# EAGLE design uOsc_1_v3 (EAGLE 9.2.1)

## Sheet 1 of 3
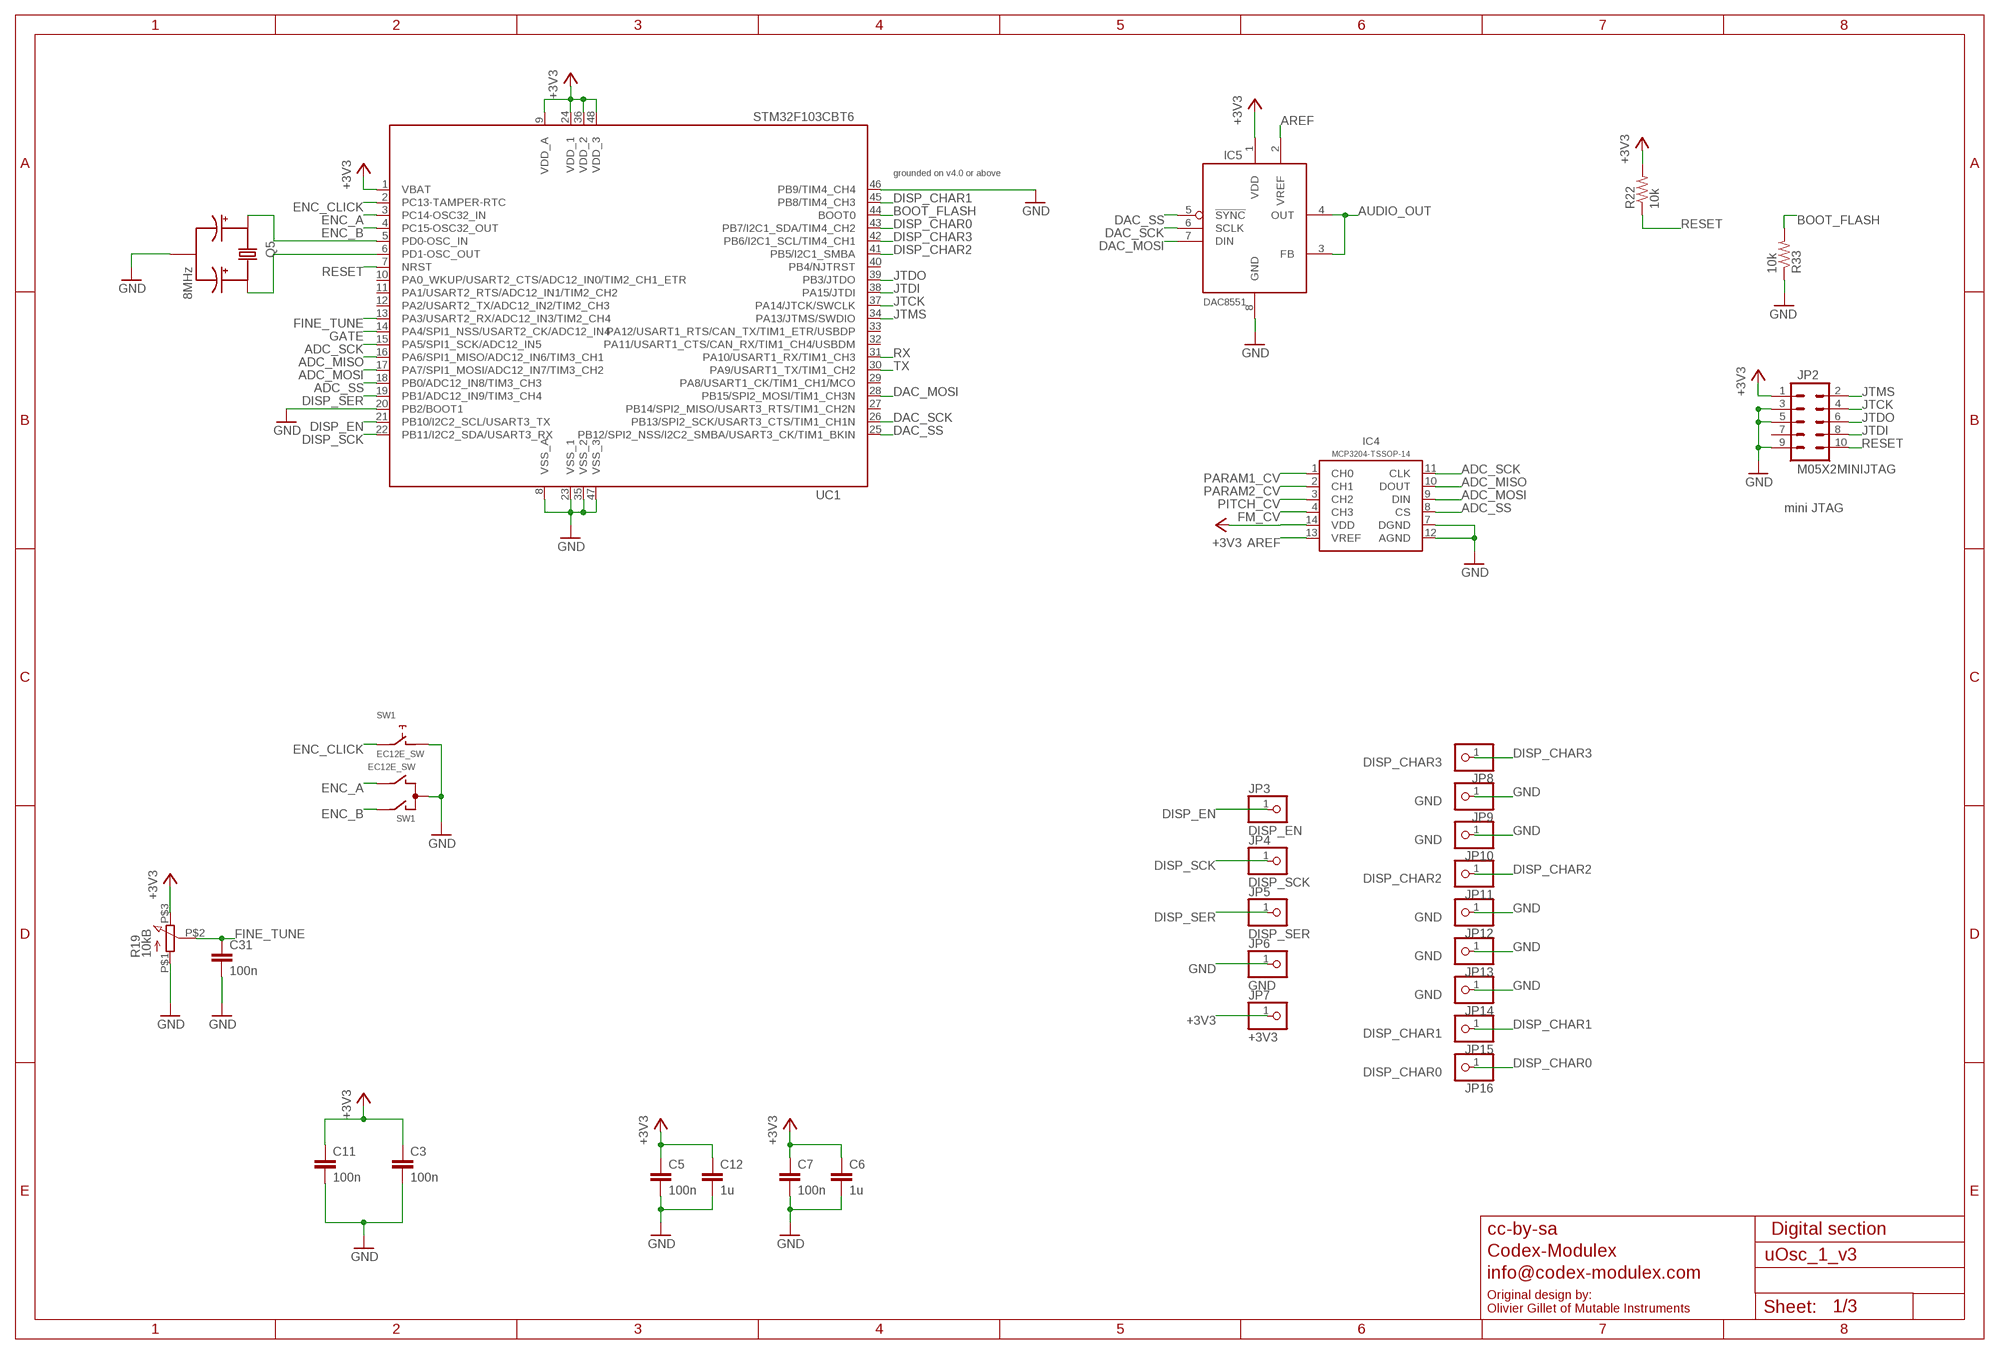
[diagram p0: schematic, sheet 1]

### Parts
C3  100n  PARTS_AMAN_CAPACITOR  [PARTS_AMAN_RESISTOR_0603]
C5  100n  PARTS_AMAN_CAPACITOR  [PARTS_AMAN_RESISTOR_0603]
C6  1u  PARTS_AMAN_CAPACITOR  [PARTS_AMAN_RESISTOR_0603]
C7  100n  PARTS_AMAN_CAPACITOR  [PARTS_AMAN_RESISTOR_0603]
C11  100n  PARTS_AMAN_CAPACITOR  [PARTS_AMAN_RESISTOR_0603]
C12  1u  PARTS_AMAN_CAPACITOR  [PARTS_AMAN_RESISTOR_0603]
C31  100n  PARTS_AMAN_CAPACITOR  [PARTS_AMAN_RESISTOR_0603]
IC4  MCP3204-TSSOP-14  UBRAIDS_SE_MCP3204-TSSOP-14  [UBRAIDS_SE_TSSOP-14]
IC5  DAC8551  DAC855X  [MSOP-8]
JP2  M05X2MINIJTAG  [2X5-1.27]
JP3  DISP_EN  PARTS_AMAN_PINHD-1X1  [PARTS_AMAN_1X01]
JP4  DISP_SCK  PARTS_AMAN_PINHD-1X1  [PARTS_AMAN_1X01]
JP5  DISP_SER  PARTS_AMAN_PINHD-1X1  [PARTS_AMAN_1X01]
JP6  GND  PARTS_AMAN_PINHD-1X1  [PARTS_AMAN_1X01]
JP7  +3V3  PARTS_AMAN_PINHD-1X1  [PARTS_AMAN_1X01]
JP8  DISP_CHAR3  PARTS_AMAN_PINHD-1X1  [PARTS_AMAN_1X01]
JP9  GND  PARTS_AMAN_PINHD-1X1  [PARTS_AMAN_1X01]
JP10  GND  PARTS_AMAN_PINHD-1X1  [PARTS_AMAN_1X01]
JP11  DISP_CHAR2  PARTS_AMAN_PINHD-1X1  [PARTS_AMAN_1X01]
JP12  GND  PARTS_AMAN_PINHD-1X1  [PARTS_AMAN_1X01]
JP13  GND  PARTS_AMAN_PINHD-1X1  [PARTS_AMAN_1X01]
JP14  GND  PARTS_AMAN_PINHD-1X1  [PARTS_AMAN_1X01]
JP15  DISP_CHAR1  PARTS_AMAN_PINHD-1X1  [PARTS_AMAN_1X01]
JP16  DISP_CHAR0  PARTS_AMAN_PINHD-1X1  [PARTS_AMAN_1X01]
Q5  8MHz  CRYSTAL_SMALLER  [CRYSTAL_SMALLER]
R19  10kB  Q-POT2  [Q-POT2]
R22  10k  PARTS_AMAN_RESISTOR  [PARTS_AMAN_RESISTOR_0603]
R33  10k  PARTS_AMAN_RESISTOR  [PARTS_AMAN_RESISTOR_0603]
SW1  EC12E_SW  [ALPS_EC12E_SW]
UC1  STM32F103CBT6  STM32F103CB  [LQFP48]

### Nets
+3V3: C3.1 C5.1 C6.1 C7.1 C11.1 C12.1 IC4.14(VDD) IC5.1(VDD) JP2.1 JP7.1 R19.P$3 R22.2 UC1.1(VBAT) UC1.9(VDD_A) UC1.24(VDD_1) UC1.36(VDD_2) UC1.48(VDD_3) ; also sheet 2,3
ADC_MISO: IC4.10(DOUT) UC1.16(PA6/SPI1_MISO/ADC12_IN6/TIM3_CH1)
ADC_MOSI: IC4.9(DIN) UC1.17(PA7/SPI1_MOSI/ADC12_IN7/TIM3_CH2)
ADC_SCK: IC4.11(CLK) UC1.15(PA5/SPI1_SCK/ADC12_IN5)
ADC_SS: IC4.8(CS) UC1.18(PB0/ADC12_IN8/TIM3_CH3)
AREF: IC4.13(VREF) IC5.2(VREF) ; also sheet 3
AUDIO_OUT: IC5.3(FB) IC5.4(OUT) ; also sheet 2
BOOT_FLASH: R33.2 UC1.44(BOOT0)
DAC_MOSI: IC5.7(DIN) UC1.28(PB15/SPI2_MOSI/TIM1_CH3N)
DAC_SCK: IC5.6(SCLK) UC1.26(PB13/SPI2_SCK/USART3_CTS/TIM1_CH1N)
DAC_SS: IC5.5(!SYNC) UC1.25(PB12/SPI2_NSS/I2C2_SMBA/USART3_CK/TIM1_BKIN)
DISP_CHAR0: JP16.1 UC1.43(PB7/I2C1_SDA/TIM4_CH2)
DISP_CHAR1: JP15.1 UC1.45(PB8/TIM4_CH3)
DISP_CHAR2: JP11.1 UC1.41(PB5/I2C1_SMBA)
DISP_CHAR3: JP8.1 UC1.42(PB6/I2C1_SCL/TIM4_CH1)
DISP_EN: JP3.1 UC1.21(PB10/I2C2_SCL/USART3_TX)
DISP_SCK: JP4.1 UC1.22(PB11/I2C2_SDA/USART3_RX)
DISP_SER: JP5.1 UC1.19(PB1/ADC12_IN9/TIM3_CH4)
ENC_A: SW1.B UC1.3(PC14-OSC32_IN)
ENC_B: SW1.A UC1.4(PC15-OSC32_OUT)
ENC_CLICK: SW1.E UC1.2(PC13-TAMPER-RTC)
FINE_TUNE: C31.1 R19.P$2 UC1.13(PA3/USART2_RX/ADC12_IN3/TIM2_CH4)
FM_CV: IC4.4(CH3) ; also sheet 2
GATE: UC1.14(PA4/SPI1_NSS/USART2_CK/ADC12_IN4) ; also sheet 2
GND: C3.2 C5.2 C6.2 C7.2 C11.2 C12.2 C31.2 IC4.7(DGND) IC4.12(AGND) IC5.8(GND) JP2.3 JP2.5 JP2.9 JP6.1 JP9.1 JP10.1 JP12.1 JP13.1 JP14.1 Q5.GND R19.P$1 R33.1 SW1.C SW1.D UC1.8(VSS_A) UC1.20(PB2/BOOT1) UC1.23(VSS_1) UC1.35(VSS_2) UC1.46(PB9/TIM4_CH4) UC1.47(VSS_3) ; also sheet 2,3
JTCK: JP2.4 UC1.37(PA14/JTCK/SWCLK)
JTDI: JP2.8 UC1.38(PA15/JTDI)
JTDO: JP2.6 UC1.39(PB3/JTDO)
JTMS: JP2.2 UC1.34(PA13/JTMS/SWDIO)
N$7: Q5.X1 UC1.5(PD0-OSC_IN)
N$8: Q5.X2 UC1.6(PD1-OSC_OUT)
PARAM1_CV: IC4.1(CH0) ; also sheet 2
PARAM2_CV: IC4.2(CH1) ; also sheet 2
PITCH_CV: IC4.3(CH2) ; also sheet 2
RESET: JP2.10 R22.1 UC1.7(NRST)
RX: UC1.31(PA10/USART1_RX/TIM1_CH3)
TX: UC1.30(PA9/USART1_TX/TIM1_CH2)
Unconnected: JP2.7 SW1.GND1(G) SW1.GND2(G) UC1.10(PA0_WKUP/USART2_CTS/ADC12_IN0/TIM2_CH1_ETR) UC1.11(PA1/USART2_RTS/ADC12_IN1/TIM2_CH2) UC1.12(PA2/USART2_TX/ADC12_IN2/TIM2_CH3) UC1.27(PB14/SPI2_MISO/USART3_RTS/TIM1_CH2N) UC1.29(PA8/USART1_CK/TIM1_CH1/MCO) UC1.32(PA11/USART1_CTS/CAN_RX/TIM1_CH4/USBDM) UC1.33(PA12/USART1_RTS/CAN_TX/TIM1_ETR/USBDP) UC1.40(PB4/NJTRST)

### Notes on the sheet
- grounded on v4.0 or above
- mini JTAG
- cc-by-sa | Digital section
- Codex-Modulex
- info@codex-modulex.com
- Original design by:
  Olivier Gillet of Mutable Instruments

## Sheet 2 of 3
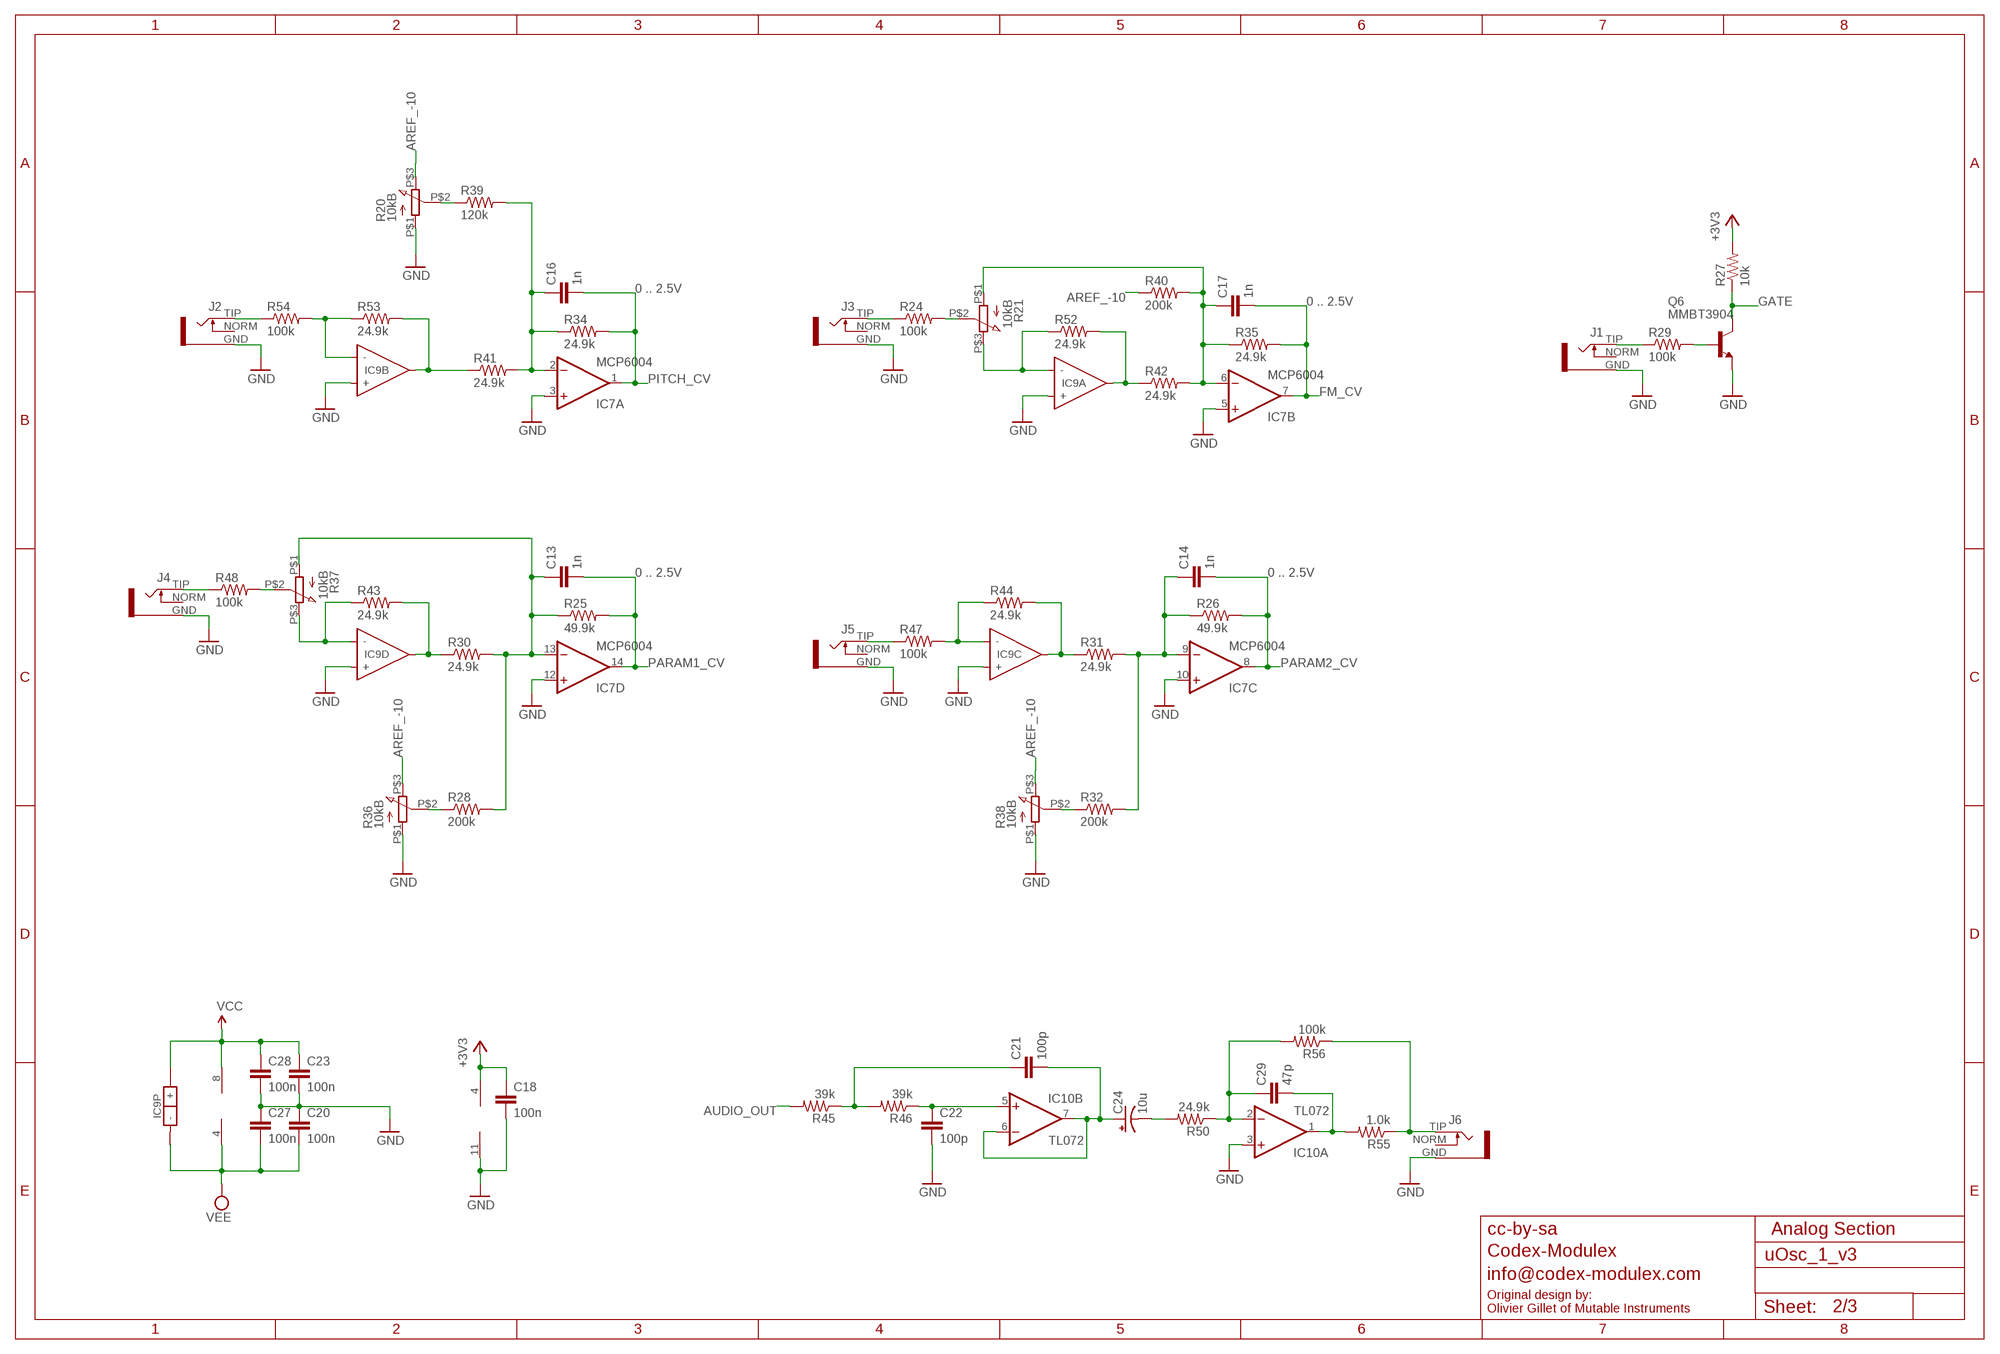
[diagram p1: schematic, sheet 2]

### Parts
C13  1n  PARTS_AMAN_CAPACITOR  [PARTS_AMAN_RESISTOR_0603]
C14  1n  PARTS_AMAN_CAPACITOR  [PARTS_AMAN_RESISTOR_0603]
C16  1n  PARTS_AMAN_CAPACITOR  [PARTS_AMAN_RESISTOR_0603]
C17  1n  PARTS_AMAN_CAPACITOR  [PARTS_AMAN_RESISTOR_0603]
C18  100n  PARTS_AMAN_CAPACITOR  [PARTS_AMAN_RESISTOR_0603]
C20  100n  PARTS_AMAN_CAPACITOR  [PARTS_AMAN_RESISTOR_0603]
C21  100p  PARTS_AMAN_CAPACITOR  [PARTS_AMAN_RESISTOR_0603]
C22  100p  PARTS_AMAN_CAPACITOR  [PARTS_AMAN_RESISTOR_0603]
C23  100n  PARTS_AMAN_CAPACITOR  [PARTS_AMAN_RESISTOR_0603]
C24  10u  CPOL-USB  [PANASONIC_B]
C27  100n  PARTS_AMAN_CAPACITOR  [PARTS_AMAN_RESISTOR_0603]
C28  100n  PARTS_AMAN_CAPACITOR  [PARTS_AMAN_RESISTOR_0603]
C29  47p  PARTS_AMAN_CAPACITOR  [PARTS_AMAN_RESISTOR_0603]
IC7  MCP6004  TL074D  [SO14]
IC9  TL074  UBRAIDS_SE_TL074-TSSOP-14  [UBRAIDS_SE_TSSOP-14]
IC10  TL072  TL072D  [SO08]
J1  S_JACK_S2_INV  [S_JACK_S2_INV]
J2  S_JACK_S2_INV  [S_JACK_S2_INV]
J3  S_JACK_S2_INV  [S_JACK_S2_INV]
J4  S_JACK_S2_INV  [S_JACK_S2_INV]
J5  S_JACK_S2_INV  [S_JACK_S2_INV]
J6  S_JACK_S2_INV  [S_JACK_S2_INV]
Q6  MMBT3904  MMBT3904LT1-NPN-SOT23-BEC  [SOT23-BEC]
R20  10kB  Q-POT2  [Q-POT2]
R21  10kB  Q-POT2  [Q-POT2]
R24  100k  PARTS_AMAN_RESISTOR  [PARTS_AMAN_RESISTOR_0603]
R25  49.9k  PARTS_AMAN_RESISTOR  [PARTS_AMAN_RESISTOR_0603]
R26  49.9k  PARTS_AMAN_RESISTOR  [PARTS_AMAN_RESISTOR_0603]
R27  10k  PARTS_AMAN_RESISTOR  [PARTS_AMAN_RESISTOR_0603]
R28  200k  PARTS_AMAN_RESISTOR  [PARTS_AMAN_RESISTOR_0603]
R29  100k  PARTS_AMAN_RESISTOR  [PARTS_AMAN_RESISTOR_0603]
R30  24.9k  PARTS_AMAN_RESISTOR  [PARTS_AMAN_RESISTOR_0603]
R31  24.9k  PARTS_AMAN_RESISTOR  [PARTS_AMAN_RESISTOR_0603]
R32  200k  PARTS_AMAN_RESISTOR  [PARTS_AMAN_RESISTOR_0603]
R34  24.9k  PARTS_AMAN_RESISTOR  [PARTS_AMAN_RESISTOR_0603]
R35  24.9k  PARTS_AMAN_RESISTOR  [PARTS_AMAN_RESISTOR_0603]
R36  10kB  Q-POT2  [Q-POT2]
R37  10kB  Q-POT2  [Q-POT2]
R38  10kB  Q-POT2  [Q-POT2]
R39  120k  PARTS_AMAN_RESISTOR  [PARTS_AMAN_RESISTOR_0603]
R40  200k  PARTS_AMAN_RESISTOR  [PARTS_AMAN_RESISTOR_0603]
R41  24.9k  PARTS_AMAN_RESISTOR  [PARTS_AMAN_RESISTOR_0603]
R42  24.9k  PARTS_AMAN_RESISTOR  [PARTS_AMAN_RESISTOR_0603]
R43  24.9k  PARTS_AMAN_RESISTOR  [PARTS_AMAN_RESISTOR_0603]
R44  24.9k  PARTS_AMAN_RESISTOR  [PARTS_AMAN_RESISTOR_0603]
R45  39k  PARTS_AMAN_RESISTOR  [PARTS_AMAN_RESISTOR_0603]
R46  39k  PARTS_AMAN_RESISTOR  [PARTS_AMAN_RESISTOR_0603]
R47  100k  PARTS_AMAN_RESISTOR  [PARTS_AMAN_RESISTOR_0603]
R48  100k  PARTS_AMAN_RESISTOR  [PARTS_AMAN_RESISTOR_0603]
R50  24.9k  PARTS_AMAN_RESISTOR  [PARTS_AMAN_RESISTOR_0603]
R52  24.9k  PARTS_AMAN_RESISTOR  [PARTS_AMAN_RESISTOR_0603]
R53  24.9k  PARTS_AMAN_RESISTOR  [PARTS_AMAN_RESISTOR_0603]
R54  100k  PARTS_AMAN_RESISTOR  [PARTS_AMAN_RESISTOR_0603]
R55  1.0k  PARTS_AMAN_RESISTOR  [PARTS_AMAN_RESISTOR_0603]
R56  100k  PARTS_AMAN_RESISTOR  [PARTS_AMAN_RESISTOR_0603]

### Nets
+3V3: C18.1 IC7.4(P:V+) R27.2 ; also sheet 1,3
AREF_-10: R20.P$3 R36.P$3 R38.P$3 R40.1 ; also sheet 3
AUDIO_OUT: R45.2 ; also sheet 1
FM_CV: C17.2 IC7.7(B:OUT) R35.2 ; also sheet 1
GATE: Q6.C R27.1 ; also sheet 1
GND: C18.2 C20.1 C22.2 C23.2 C27.1 C28.2 IC7.3(A:+IN) IC7.5(B:+IN) IC7.10(C:+IN) IC7.11(P:V-) IC7.12(D:+IN) IC9.3(A:+) IC9.5(B:+) IC9.10(C:+) IC9.12(D:+) IC10.3(A:+IN) J1.GND J2.GND J3.GND J4.GND J5.GND J6.GND Q6.E R20.P$1 R36.P$1 R38.P$1 ; also sheet 1,3
N$12: IC9.7(B:OUT) R41.1 R53.2
N$13: R20.P$2 R39.1
N$14: J2.TIP R54.1
N$29: C16.1 IC7.2(A:-IN) R34.1 R39.2 R41.2
N$45: IC9.6(B:-) R53.1 R54.2
N$46: J3.TIP R24.1
N$47: J4.TIP R48.1
N$48: R21.P$2 R24.2
N$50: IC9.13(D:-) R37.P$3 R43.1
N$51: IC9.14(D:OUT) R30.1 R43.2
N$52: IC9.2(A:-) R21.P$3 R52.1
N$53: IC9.1(A:OUT) R42.1 R52.2
N$55: C17.1 IC7.6(B:-IN) R21.P$1 R35.1 R40.2 R42.2
N$57: J1.TIP R29.1
N$58: IC9.8(C:OUT) R31.1 R44.2
N$59: C13.1 IC7.13(D:-IN) R25.1 R28.2 R30.2 R37.P$1
N$60: J5.TIP R47.1
N$61: R28.1 R36.P$2
N$62: R37.P$2 R48.2
N$63: IC9.9(C:-) R44.1 R47.2
N$65: R32.1 R38.P$2
N$66: Q6.B R29.2
N$67: C21.2 C24.+ IC10.6(B:-IN) IC10.7(B:OUT)
N$68: C24.- R50.2
N$69: C22.1 IC10.5(B:+IN) R46.1
N$70: C14.1 IC7.9(C:-IN) R26.1 R31.2 R32.2
N$71: C21.1 R45.1 R46.2
N$72: J6.TIP R55.1 R56.1
N$73: C29.2 IC10.1(A:OUT) R55.2
N$75: C29.1 IC10.2(A:-IN) R50.1 R56.2
PARAM1_CV: C13.2 IC7.14(D:OUT) R25.2 ; also sheet 1
PARAM2_CV: C14.2 IC7.8(C:OUT) R26.2 ; also sheet 1
PITCH_CV: C16.2 IC7.1(A:OUT) R34.2 ; also sheet 1
VCC: C23.1 C28.1 IC9.4(P:+) IC10.8(P:V+) ; also sheet 3
VEE: C20.2 C27.2 IC9.11(P:-) IC10.4(P:V-) ; also sheet 3
Unconnected: J1.NORM J2.NORM J3.NORM J4.NORM J5.NORM J6.NORM

### Notes on the sheet
- 0 .. 2.5V
- 0 .. 2.5V
- 0 .. 2.5V | 0 .. 2.5V
- cc-by-sa | Analog Section
- Codex-Modulex
- info@codex-modulex.com
- Original design by:
  Olivier Gillet of Mutable Instruments

## Sheet 3 of 3
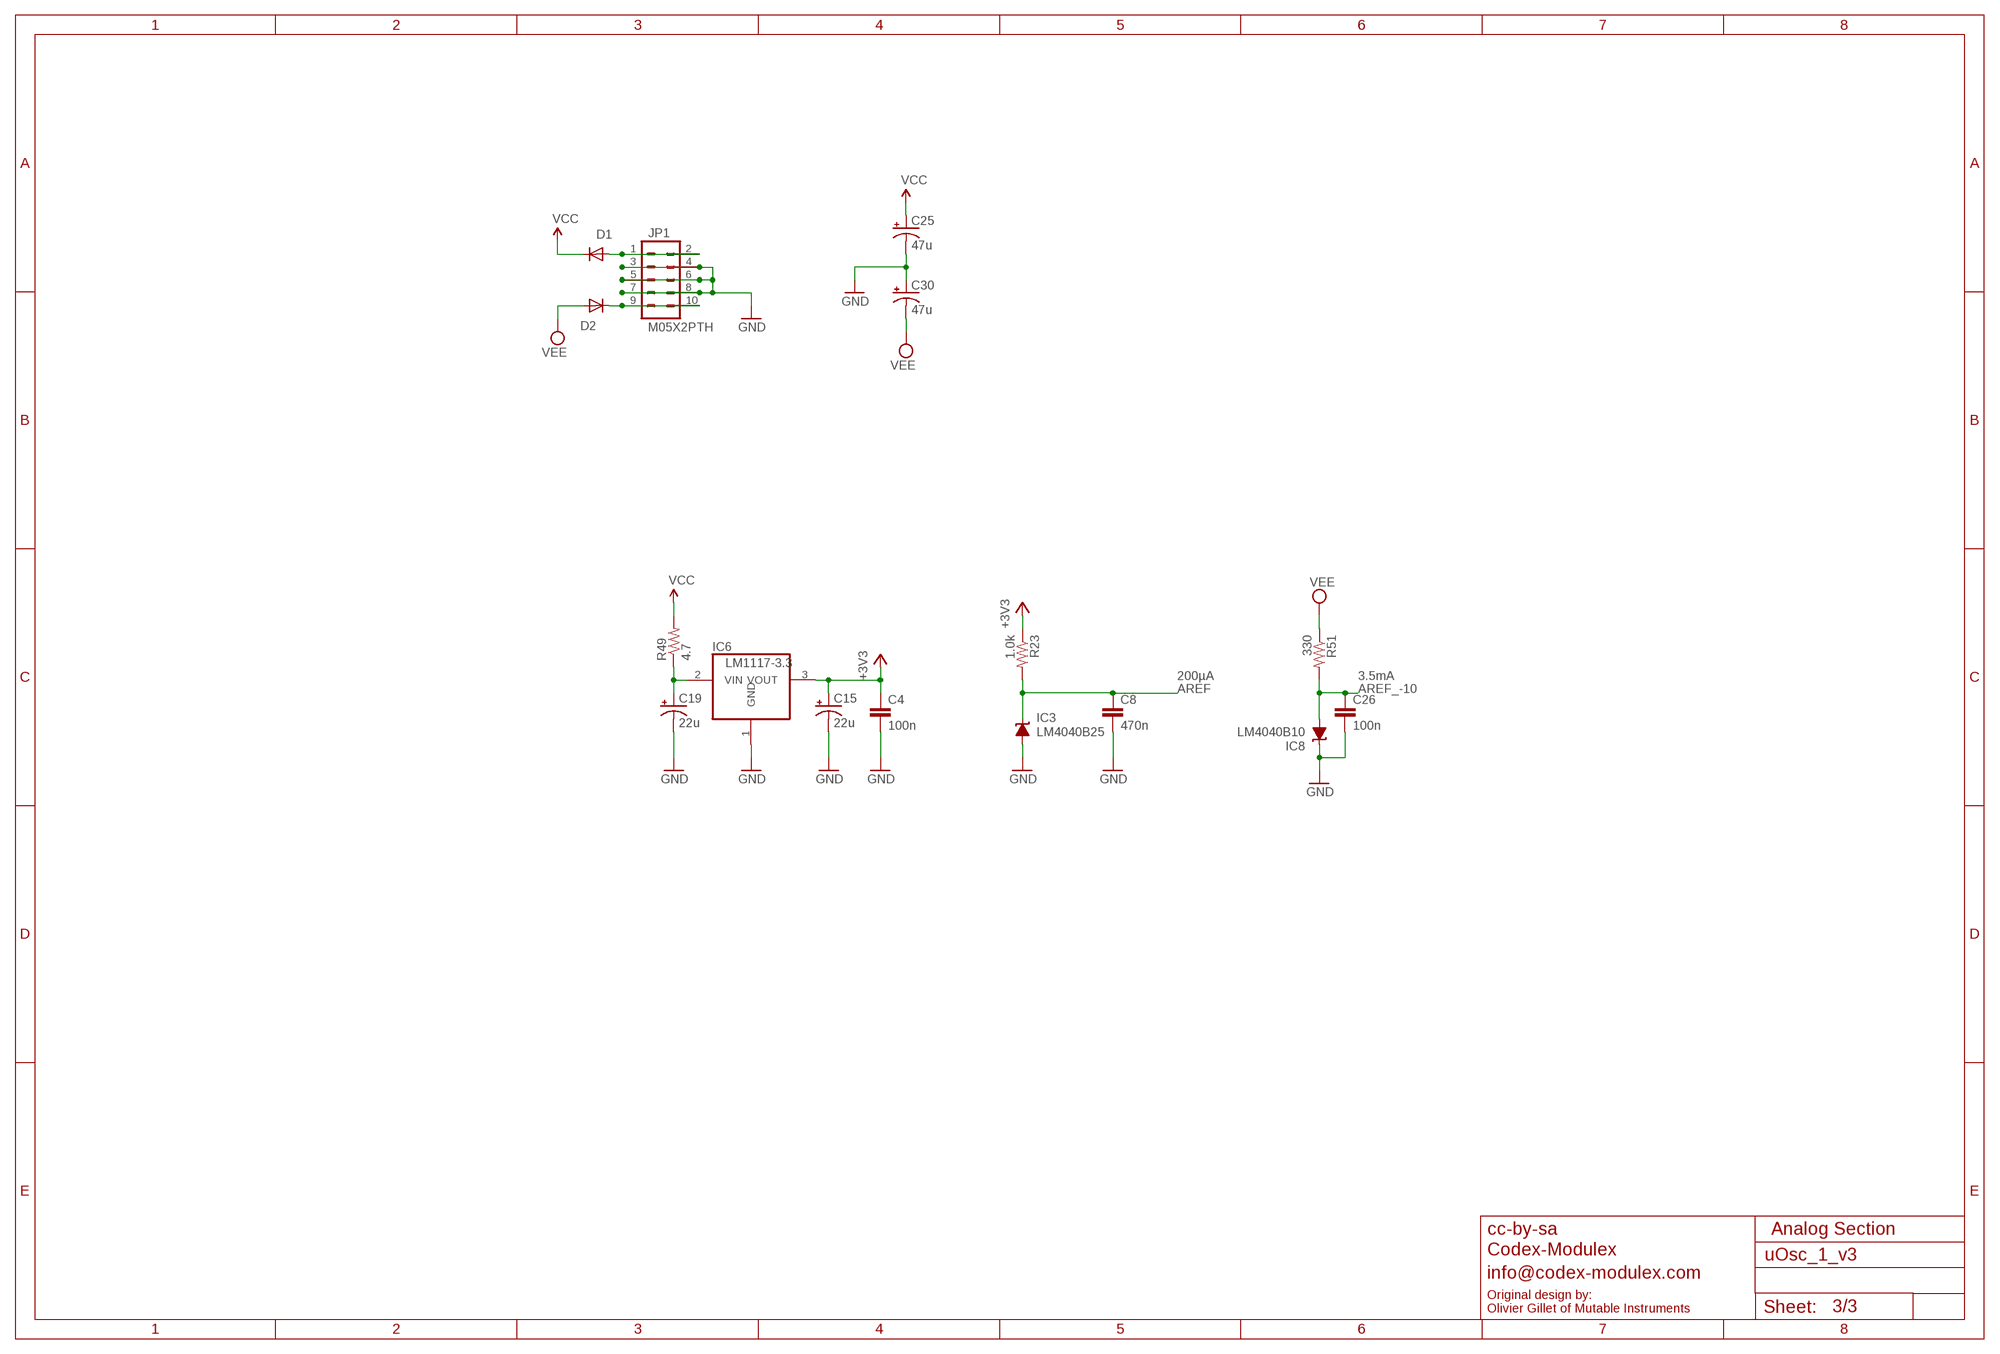
[diagram p2: schematic, sheet 3]

### Parts
C4  100n  PARTS_AMAN_CAPACITOR  [PARTS_AMAN_RESISTOR_0603]
C8  470n  PARTS_AMAN_CAPACITOR  [PARTS_AMAN_RESISTOR_0603]
C15  22u  CPOL-USC  [PANASONIC_C]
C19  22u  CPOL-USC  [PANASONIC_C]
C25  47u  CPOL-USD  [PANASONIC_D]
C26  100n  PARTS_AMAN_CAPACITOR  [PARTS_AMAN_RESISTOR_0603]
C30  47u  CPOL-USD  [PANASONIC_D]
D1  1N5819HW  DIODE-SOD123  [SOD123]
D2  1N5819HW  DIODE-SOD123  [SOD123]
IC3  LM4040B25  LM4041B12DBZ  [DBZ_R-PDSO-G3]
IC6  LM1117-3.3  REG1117T  [TO252]
IC8  LM4040B10  LM4041B12DBZ  [DBZ_R-PDSO-G3]
JP1  M05X2PTH  [AVR_ICSP]
R23  1.0k  PARTS_AMAN_RESISTOR  [PARTS_AMAN_RESISTOR_0603]
R49  4.7  R-US_R1206  [R1206]
R51  330  PARTS_AMAN_RESISTOR  [PARTS_AMAN_RESISTOR_0603]

### Nets
+3V3: C4.1 C15.+ IC6.3(VOUT) R23.1 ; also sheet 1,2
AREF: C8.1 IC3.1(C) R23.2 ; also sheet 1
AREF_-10: C26.1 IC8.2(A) R51.2 ; also sheet 2
GND: C4.2 C8.2 C15.- C19.- C25.- C26.2 C30.+ IC3.2(A) IC6.1(GND) IC8.1(C) JP1.3 JP1.4 JP1.5 JP1.6 JP1.7 JP1.8 ; also sheet 1,2
N$49: C19.+ IC6.2(VIN) R49.1
N$56: D1.A JP1.1 JP1.2
N$64: D2.C JP1.9 JP1.10
VCC: C25.+ D1.C R49.2 ; also sheet 2
VEE: C30.- D2.A R51.1 ; also sheet 2

### Notes on the sheet
- 200µA | 3.5mA
- cc-by-sa | Analog Section
- Codex-Modulex
- info@codex-modulex.com
- Original design by:
  Olivier Gillet of Mutable Instruments

## Library data of the parts
C3-C8 C11-C14 C16-C18 C20-C23 C26-C29 C31 = atom_v1_1_board_2:PARTS_AMAN_CAPACITOR
C15 C19 C24 C25 C30 = rcl:CPOL-US: POLARIZED CAPACITOR, American symbol
D1 D2 = diode:DIODE-: DIODE
IC3 IC8 = texas:LM4041: PRECISION MICROPOWER SHUNT VOLTAGE REFERENCE Source: http://focus.ti.com/lit/ds/slcs146e/slcs146e.pdf
IC4 = uBraids_SE_Main_Board:UBRAIDS_SE_MCP3204
IC5 = og-dac:DAC855X: 16-bit low-glitch DAC with 2's complement (8550) or unsigned code (8551)
IC6 = og-vreg:REG1117: 800mA and 1A Low Dropout (LDO) Positive Regulator 1.8V, 2.5V, 2.85V, 3.3V, 5V, and Adj
IC7 = gm-ics:TL074: OP AMP
IC9 = uBraids_SE_Main_Board:UBRAIDS_SE_TL074: OP AMP
IC10 = linear:TL072: OP AMP
J1-J6 = uClouds_002:S_JACK_S2_INV
JP1 JP2 = og-header:M05X2: Header 5x2 Standard 10-pin dual row 0.1" header. Commonly used with AVR-ISP. Use with Spark Fun Electronics SKU: PRT-00778
JP3-JP16 = atom_v1_1_board_2:PARTS_AMAN_PINHD-1X1: PIN HEADER
Q5 = uClouds_002:CRYSTAL_SMALLER: CSTCE16M0V53-R0
Q6 = transistor:*-NPN-: NPN Transistror BF959 corrected 2008.03.06
R19-R21 R36-R38 = uClouds_002:Q-POT2
R22-R35 R39-R48 R50-R56 = atom_v1_1_board_2:PARTS_AMAN_RESISTOR
R49 = rcl:R-US_: RESISTOR, American symbol
SW1 = og-encoder:EC12E_SW: ALPS rotary Encoder EC12E series with switch
UC1 = stm32:STM32F103CB

## Board
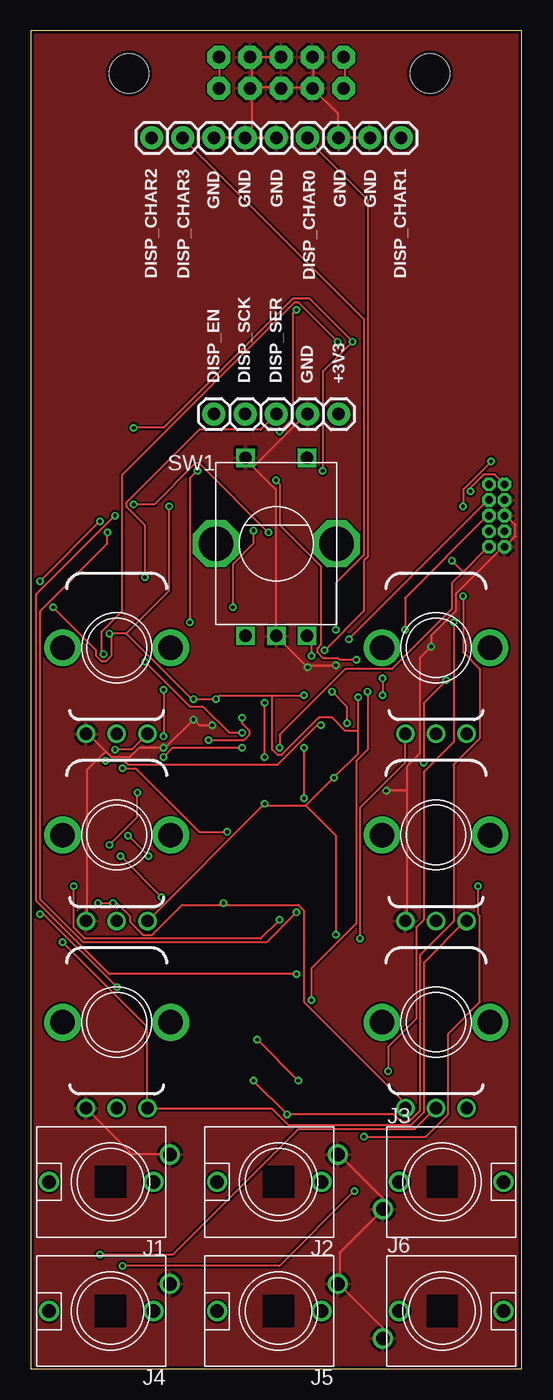
[diagram p3: board, top side]
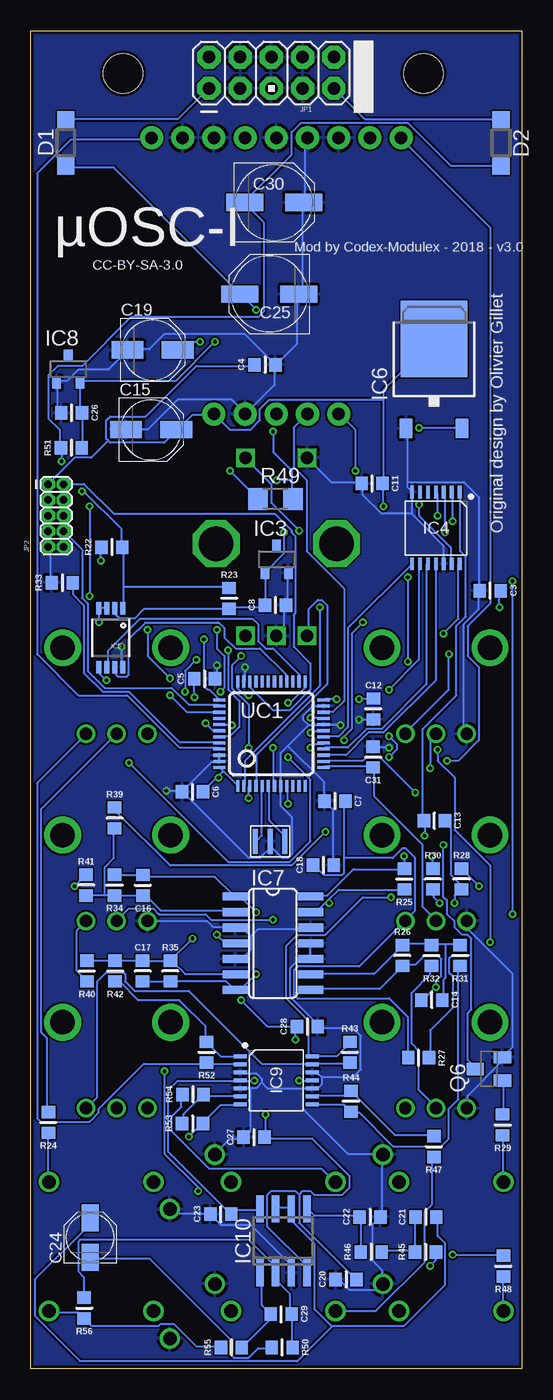
[diagram p4: board, bottom side, seen from below]

Size 40 x 109 mm. Coordinates in mm from the lower left corner, seen from the top.
Outline: 0,0 40,0 40,109 0,109 0,0
Copper layers (1*16): Top 0.035mm / dielectric 1.5mm / Bottom 0.035mm
Design rules "dirt_cheap_dirty_boards.v1.1": minimum track width 6mil, minimum drill 12mil, track to track 6mil, track to pad 6mil, pad to pad 6mil, via to via 6mil, smd to smd 0mil, copper to edge 10mil, drill to drill 10mil, minimum pad ring 10mil, minimum via ring 6mil, stop-mask expansion 2mil, vias tented up to drill 25mil, thermal gap 10mil
Holes 3.2 mm at 8,105.5 32.5,105.5

### Footprints (pad centres in the part's own frame; a part is rotated, then mirrored left to right if it is on the bottom)
PARTS_AMAN_RESISTOR_0603 = smd 1 x 1.1: 1 -0.85,0; 2 0.85,0
PANASONIC_C = smd 2.6 x 1.4: + 2.05,0; - -2.05,0
PANASONIC_B = smd 2.2 x 1.4: + 1.6,0; - -1.6,0
PANASONIC_D = smd 3 x 1.4: + 2.4,0; - -2.4,0
SOD123 = smd 1.4 x 1.4: A 1.9,0; C -1.9,0
DBZ_R-PDSO-G3 = smd 0.7 x 1: 1 -0.95,-1.1; 2 0.95,-1.1; 3 0,1.1
UBRAIDS_SE_TSSOP-14 = smd 0.32 x 1.05: 1 -1.95,-2.925; 2 -1.3,-2.925; 3 -0.65,-2.925; 4 0,-2.925; 5 0.65,-2.925; 6 1.3,-2.925; 7 1.95,-2.925; 8 1.95,2.925; 9 1.3,2.925; 10 0.65,2.925; 11 0,2.925; 12 -0.65,2.925; 13 -1.3,2.925; 14 -1.95,2.925
MSOP-8 = smd 0.41 x 1.02: 1 -0.975,-2.4; 2 -0.325,-2.4; 3 0.325,-2.4; 4 0.975,-2.4; 5 0.975,2.4; 6 0.325,2.4; 7 -0.325,2.4; 8 -0.975,2.4
TO252 = smd 1 x 1.6: 1 -2.28,-4.8; 2 2.28,-4.8 | smd 5.4 x 6.2: 3 0,2.5
SO14 = smd 0.66 x 2.032: 1 -3.81,-3.073; 2 -2.54,-3.073; 3 -1.27,-3.073; 4 0,-3.073; 5 1.27,-3.073; 6 2.54,-3.073; 7 3.81,-3.073; 8 3.81,3.073; 9 2.54,3.073; 10 1.27,3.073; 11 0,3.073; 12 -1.27,3.073; 13 -2.54,3.073; 14 -3.81,3.073
SO08 = smd 0.6 x 2.2: 1 -1.905,-2.6; 2 -0.635,-2.6; 3 0.635,-2.6; 4 1.905,-2.6; 5 1.905,2.6; 6 0.635,2.6; 7 -0.635,2.6; 8 -1.905,2.6
S_JACK_S2_INV = drill 1.1: GND 2.223,-4.826; NORM 0,-3.5; TIP 0,5
AVR_ICSP = drill 1.016 pad 1.88 octagon: 1 -1.27,5.08; 2 1.27,5.08; 3 -1.27,2.54; 4 1.27,2.54; 5 -1.27,0; 6 1.27,0; 7 -1.27,-2.54; 8 1.27,-2.54; 9 -1.27,-5.08; 10 1.27,-5.08
2X5-1.27 = drill 0.61 pad 1.067 octagon: 1 -1.27,3.81; 2 0,3.81; 3 -1.27,2.54; 4 0,2.54; 5 -1.27,1.27; 6 0,1.27; 7 -1.27,0; 8 0,0; 9 -1.27,-1.27; 10 0,-1.27
PARTS_AMAN_1X01 = drill 1.016 pad 1.88: 1 0,0
CRYSTAL_SMALLER = smd 0.4 x 2: GND 0,0; X1 -1.2,0; X2 1.2,0
SOT23-BEC = smd 1 x 1.4: B -0.95,-1.1; C 0,1.1; E 0.95,-1.1
Q-POT2 = drill 1 pad 1.5: P$1 -2.5,-7; P$2 0,-7; P$3 2.5,-7 | drill 2 pad 2.5: P$4 -4.4,0; P$5 4.4,0
R1206 = smd 1.6 x 1.803: 1 -1.422,0; 2 1.422,0
ALPS_EC12E_SW = drill 1 square: A -2.5,-7.5; B 2.5,-7.5; C 0,-7.5; D -2.5,7; E 2.5,7 | drill 2.8 octagon: GND1 -4.9,0; GND2 4.9,0
LQFP48 = smd 0.254 x 1: 1 -2.75,-4.25; 2 -2.25,-4.25; 3 -1.75,-4.25; 4 -1.25,-4.25; 5 -0.75,-4.25; 6 -0.25,-4.25; 7 0.25,-4.25; 8 0.75,-4.25; 9 1.25,-4.25; 10 1.75,-4.25; 11 2.25,-4.25; 12 2.75,-4.25; 25 2.75,4.25; 26 2.25,4.25; 27 1.75,4.25; 28 1.25,4.25; 29 0.75,4.25; 30 0.25,4.25; 31 -0.25,4.25; 32 -0.75,4.25; 33 -1.25,4.25; 34 -1.75,4.25; 35 -2.25,4.25; 36 -2.75,4.25 | smd 1 x 0.254: 13 4.25,-2.75; 14 4.25,-2.25; 15 4.25,-1.75; 16 4.25,-1.25; 17 4.25,-0.75; 18 4.25,-0.25; 19 4.25,0.25; 20 4.25,0.75; 21 4.25,1.25; 22 4.25,1.75; 23 4.25,2.25; 24 4.25,2.75; 37 -4.25,2.75; 38 -4.25,2.25; 39 -4.25,1.75; 40 -4.25,1.25; 41 -4.25,0.75; 42 -4.25,0.25; 43 -4.25,-0.25; 44 -4.25,-0.75; 45 -4.25,-1.25; 46 -4.25,-1.75; 47 -4.25,-2.25; 48 -4.25,-2.75

### Placement (x,y rotation side)
C3  2.58,63.38 180 bottom
C4  20.92,81.79 0 bottom
C5  25.84,56.21 0 bottom
C6  26.82,46.99 180 bottom
C7  15.22,46.25 180 bottom
C8  20.07,62.21 0 bottom
C11  12.2,72.12 180 bottom
C12  12.1,53.75 270 bottom
C13  7.12,44.65 180 bottom
C14  7.34,30.05 180 bottom
C15  30.19,76.5 0 bottom
C16  30.86,39.38 90 bottom
C17  30.88,32.4 270 bottom
C18  16.17,41.02 0 bottom
C19  30.07,83 0 bottom
C20  14.32,7.29 0 bottom
C21  7.82,12.37 0 bottom
C22  12.37,12.37 0 bottom
C23  24.52,12.6 180 bottom
C24  35.15,10.7 90 bottom
C25  20.57,87.55 180 bottom
C26  36.67,77.87 180 bottom
C27  21.82,18.87 0 bottom
C28  17.47,27.87 0 bottom
C29  19.6,4.45 180 bottom
C30  20.18,95.01 0 bottom
C31  12.12,49.83 90 bottom
D1  37.14,99.86 90 bottom
D2  1.71,99.86 270 bottom
IC3  19.97,65.93 0 bottom
IC4  7,68.5 180 bottom
IC5  33.48,59.55 180 bottom
IC6  7.15,81.4 0 bottom
IC7  20.28,34.66 270 bottom
IC8  36.94,81.43 0 bottom
IC9  20,23.5 270 bottom
IC10  19.42,10.43 0 bottom
J1  6.5,15.23 90 top
J2  20.18,15.23 90 top
J3  33.5,15.23 270 top
J4  6.5,4.7 90 top
J5  20.18,4.7 90 top
J6  33.5,4.7 270 top
JP1  20.4,105.57 90 bottom
JP2  37.31,68.23 0 bottom
JP3  14.92,77.77 0 top
JP4  17.46,77.77 0 top
JP5  20,77.77 0 top
JP6  22.54,77.77 0 top
JP7  25.08,77.77 0 top
JP8  12.38,100.27 0 top
JP9  14.92,100.27 0 top
JP10  17.46,100.27 0 top
JP11  9.84,100.27 0 top
JP12  20,100.27 0 top
JP13  25.08,100.27 0 top
JP14  27.62,100.27 0 top
JP15  30.16,100.27 0 top
JP16  22.54,100.27 0 top
Q5  20.5,42.96 0 bottom
Q6  2.69,24.42 90 bottom
R19  7,43.48 0 top
R20  7,58.73 0 top
R21  33,58.73 0 top
R22  33.39,66.93 0 bottom
R23  23.84,62.75 270 bottom
R24  38.57,20.07 90 bottom
R25  9.58,39.9 90 bottom
R26  9.73,33.67 270 bottom
R27  8.41,25.33 180 bottom
R28  4.92,39.9 270 bottom
R29  1.57,19.87 90 bottom
R30  7.25,39.9 270 bottom
R31  5.03,33.67 90 bottom
R32  7.38,33.67 90 bottom
R33  37.43,64.03 0 bottom
R34  33.18,39.4 90 bottom
R35  28.63,32.4 270 bottom
R36  33,43.48 0 top
R37  33,28.23 0 top
R38  7,28.23 0 top
R39  33.17,44.87 270 bottom
R40  35.42,32.4 90 bottom
R41  35.48,39.4 270 bottom
R42  33.13,32.4 90 bottom
R43  14.02,25.79 90 bottom
R44  13.92,21.79 270 bottom
R45  7.85,9.53 0 bottom
R46  12.27,9.53 0 bottom
R47  7.17,18.1 90 bottom
R48  1.52,8.37 90 bottom
R49  20.06,70.85 0 bottom
R50  19.52,1.75 180 bottom
R51  36.69,75.03 0 bottom
R52  25.67,25.79 90 bottom
R53  26.82,19.99 0 bottom
R54  26.79,22.35 0 bottom
R55  23.66,1.75 0 bottom
R56  35.64,4.95 90 bottom
SW1  20,67.21 0 top
UC1  20.4,51.73 0 bottom

### Tracks (layer width: path | path; a pad name or v marks a point on that pad's centre or on a via)
+3V3  (via drill 0.3)
  Top 0.152: v35.81,71.48 35.81,71.78 36.88,72.85 37.8,72.85 38.56,72.08 JP2.1 | 19.66,54.86 15.39,54.86 v15.09,54.56 v13.26,54.56 13.11,54.56 7.77,59.89 | 19.66,54.86 v22.25,54.86 | 7.77,59.89 6.55,59.89 | v1.83,62.03 5.33,58.52 5.33,58.06 5.79,57.61 6.1,57.61 6.55,58.06 6.55,59.89 | 6.55,59.89 v6.4,59.89 | 18.9,45.87 9.6,36.58 R19.P$3 | 26.67,51.97 26.67,50.14 v24.69,48.16 22.4,45.87 | 26.67,51.97 v26.67,54.71 | 18.9,45.87 22.4,45.87 | 18.9,45.87 v19.05,46.02 | v24.84,35.36 24.84,43.43 22.4,45.87 | 19.66,54.86 19.66,50.44 20.12,49.99 20.42,49.99 23.47,53.03 24.54,53.03 25.6,51.97 26.67,51.97 | v11.28,70.26 11.28,63.4 7.77,59.89
  Bottom 0.152: 11.28,78.94 11.28,79.7 7.16,83.82 IC6.3 | 11.28,78.94 11.28,72.24 C11.1 11.28,72.08 v11.28,70.26 | 32.46,63.7 32.46,66.9 R22.2 32.61,67.06 32.61,68.43 35.66,71.48 v35.81,71.48 | 32.46,63.7 32.46,62.03 IC5.1 | 32.46,63.7 23.93,63.7 R23.1 | 33.68,75.59 33.53,75.44 29.11,75.44 28.19,76.35 C15.+ 28.04,76.5 26.82,77.72 25.15,77.72 JP7.1 24.99,77.72 23.77,76.5 22.1,76.5 21.34,77.27 21.34,78.18 20.57,78.94 11.28,78.94 | 33.68,75.59 33.83,75.74 33.83,77.27 33.53,77.57 30.63,77.57 26.52,81.69 21.79,81.69 C4.1 | 33.68,75.59 35.05,74.22 36.42,74.22 38.56,72.08 JP2.1 | v15.09,54.56 16,54.56 UC1.24 | v13.26,54.56 12.19,54.56 C12.1 | v22.25,54.86 22.55,54.86 23.16,55.47 23.16,55.93 UC1.36 | v6.4,59.89 5.18,61.11 5.18,65.53 IC4.14 | v1.83,62.03 1.83,63.25 C3.1 | 14.48,41.6 14.48,40.39 14.63,40.23 16.15,40.23 16.92,41 C18.1 | 14.48,41.6 14.48,46.18 C7.1 | 24.23,48.62 24.54,48.92 UC1.48 | 24.23,48.62 23.16,47.55 UC1.1 | 24.84,48.16 24.38,48.62 24.23,48.62 | 24.84,48.16 25.91,47.09 C6.1 | v19.05,46.02 19.05,47.4 UC1.9 | R27.2 9.3,25.45 9.3,28.65 10.82,30.18 18.29,30.18 18.59,30.48 18.59,32.46 18.29,32.77 13.26,32.77 9.6,36.42 R19.P$3 9.45,36.58 8.69,37.34 8.69,41.6 9.45,42.37 9.75,42.37 10.52,41.6 14.48,41.6 | v26.67,54.71 26.67,56.08 C5.1 | v24.84,35.36 24.23,34.75 23.47,34.75 IC7.4 | v24.69,48.16 24.84,48.16
ADC_MISO
  Bottom 0.152: UC1.16 16,50.6 14.17,50.6 12.65,52.12 11.43,52.12 7.77,55.78 7.77,65.53 IC4.10
ADC_MOSI  (via drill 0.3)
  Top 0.152: v17.22,50.6 11.58,50.6 v10.82,49.84 | v10.82,55.32 v10.82,51.51
  Bottom 0.152: v17.22,50.6 16.92,50.9 16.15,50.9 UC1.17 | v10.82,49.84 10.21,50.44 10.21,50.9 v10.82,51.51 | v10.82,55.32 8.38,57.76 8.38,65.53 IC4.9
ADC_SCK
  Bottom 0.152: UC1.15 16,49.99 14.33,49.99 12.5,51.82 11.28,51.82 7.01,56.08 7.01,65.53 IC4.11
ADC_SS
  Bottom 0.152: UC1.18 16,51.51 14.94,51.51 14.17,52.27 14.17,60.35 8.99,65.53 IC4.8
AREF  (via drill 0.3)
  Top 0.152: v8.38,70.41 10.06,70.41 13.41,73.76 13.72,73.76 v19.36,68.12
  Bottom 0.152: IC5.2 33.07,61.87 33.07,61.42 32.77,61.11 31.55,61.11 30.79,61.87 23.93,61.87 R23.2 23.77,62.03 21.18,62.03 21.03,62.18 C8.1 20.88,62.33 20.88,64.77 IC3.1 20.88,64.92 19.36,66.45 v19.36,68.12 | v8.38,70.41 8.38,69.49 5.79,66.9 5.79,65.68 IC4.13
AREF_-10  (via drill 0.3)
  Top 0.152: R36.P$3 35.36,36.42 32,33.07 32,20.88 30.94,19.81 21.03,19.81 19.66,21.18 9.6,21.18 R38.P$3 9.45,21.34 9.45,27.89 v2.59,34.75 | v24.99,83.67 21.79,86.87 21.49,86.87 7.47,72.85 7.47,61.72 5.79,60.05 5.79,58.37 v5.94,58.22 | v6.86,50.44 8.23,50.44 9.45,51.66 R20.P$3
  Bottom 0.152: R40.1 35.51,31.7 36.27,32.46 36.27,35.66 35.51,36.42 R36.P$3 | R51.2 35.81,75.13 35.81,77.72 C26.1 35.97,77.88 35.97,80.31 IC8.2 35.97,80.47 28.19,80.47 v24.99,83.67 | v5.94,58.22 5.94,55.32 9.45,51.82 R20.P$3 | v2.59,34.75 2.59,41 5.49,43.89 5.49,48.16 6.86,49.53 v6.86,50.44
AUDIO_OUT  (via drill 0.3)
  Top 0.152: v7.47,8.38 20.27,8.38 v26.36,14.48 | v29.11,24.23 29.11,26.21 31.39,28.5 31.39,35.97 32,36.58 32,48.62 34.44,51.05 v34.44,60.81
  Bottom 0.152: IC5.3 33.83,62.03 34.44,62.03 IC5.4 34.44,61.87 v34.44,60.81 | v7.47,8.38 7.01,8.84 7.01,9.45 R45.2 | v26.36,14.48 26.36,14.78 29.11,17.53 v29.11,24.23
BOOT_FLASH
  Bottom 0.152: UC1.44 24.69,51.05 27.89,51.05 32,55.17 34.14,55.17 35.66,56.69 35.66,62.18 36.58,63.09 36.58,64.01 R33.2
DAC_MOSI
  Bottom 0.152: UC1.28 19.2,56.08 19.2,56.54 21.34,58.67 23.32,58.67 24.23,59.59 24.23,60.35 24.69,60.81 30.63,60.81 32,59.44 32,56.54 32.16,56.39 32.92,56.39 33.07,56.54 33.07,57.15 IC5.7
DAC_SCK
  Bottom 0.152: UC1.26 18.14,56.08 18.14,56.54 20.27,58.67 20.88,58.67 21.49,59.28 21.49,60.66 21.95,61.11 31.09,61.11 33.68,58.52 33.68,57.15 IC5.6
DAC_SS  (via drill 0.3)
  Top 0.152: v19.05,49.84 v19.05,54.25 | v32,49.38 32,54.25 v33.83,56.08
  Bottom 0.152: v19.05,54.25 18.9,54.25 17.68,55.47 17.68,55.93 UC1.25 | v19.05,49.84 17.22,48.01 17.22,42.98 18.9,41.3 23.93,41.3 v32,49.38 | v33.83,56.08 34.44,56.69 IC5.5
DISP_CHAR0  (via drill 0.3)
  Top 0.152: v23.93,58.52 27.13,61.72 27.13,65.84 27.43,66.14 27.43,95.25 22.55,100.13 JP16.1
  Bottom 0.152: v23.93,58.52 23.93,55.32 23.01,54.41 23.01,52.27 23.77,51.51 24.54,51.51 UC1.43
DISP_CHAR1
  Bottom 0.152: UC1.45 24.69,50.6 27.89,50.6 32.16,54.86 36.12,54.86 39.47,58.22 39.47,97.38 36.73,100.13 30.18,100.13 JP15.1
DISP_CHAR2  (via drill 0.3)
  Top 0.152: v23.62,52.43 23.32,52.43 20.12,49.23 7.92,49.23 7.62,49.53 v6.1,49.53
  Bottom 0.152: v23.62,52.43 24.54,52.43 UC1.41 | v6.1,49.53 5.18,49.53 3.5,51.21 3.5,57.15 4.42,58.06 4.42,60.5 2.59,62.33 2.59,92.96 9.75,100.13 JP11.1
DISP_CHAR3  (via drill 0.3)
  Top 0.152: v25.76,52.58 25.76,53.95 v24.54,55.17 | v24.84,60.2 24.84,64.01 27.13,66.29 27.13,85.5 12.5,100.13 JP8.1
  Bottom 0.152: v25.76,52.58 25.15,51.97 24.69,51.97 UC1.42 | v24.54,55.17 24.23,55.47 24.23,58.06 24.84,58.67 v24.84,60.2
DISP_EN  (via drill 0.3)
  Top 0.152: v17.22,53.03 17.22,52.58 17.83,51.97 17.83,51.66 17.37,51.21 v14.48,51.21 | v12.95,60.81 12.95,72.54 v13.56,73.15
  Bottom 0.152: v17.22,53.03 16.15,53.03 UC1.21 | v14.48,51.21 14.48,51.51 13.87,52.12 13.87,59.89 v12.95,60.81 | v13.56,73.15 13.56,76.5 14.78,77.72 JP3.1
DISP_SCK
  Bottom 0.152: UC1.22 16,53.49 15.39,53.49 14.48,54.41 14.48,63.55 17.53,66.6 17.53,72.39 18.59,73.46 18.59,76.66 17.53,77.72 JP4.1
DISP_SER  (via drill 0.3)
  Top 0.152: v17.22,51.82 16.15,51.82 14.02,53.95 12.95,53.95 v9.3,57.61 | v9.3,64.47 9.3,68.73 7.77,70.26 7.77,70.56 13.72,76.5 18.75,76.5 19.96,77.72 JP5.1
  Bottom 0.152: v17.22,51.82 17.07,51.97 16.15,51.97 UC1.19 | v9.3,64.47 v9.3,57.61
ENC_A  (via drill 0.3)
  Top 0.152: v22.25,50.6 v22.25,46.48 | v22.86,58.06 22.86,59.28 22.55,59.59 SW1.B
  Bottom 0.152: v22.25,46.48 22.25,47.4 UC1.3 | v22.25,50.6 22.25,54.1 23.62,55.47 23.62,57.3 v22.86,58.06
ENC_B
  Bottom 0.152: UC1.4 21.64,47.55 21.64,49.99 15.85,55.78 15.85,62.18 16.31,62.64 16.61,62.64 17.37,61.87 17.37,59.74 SW1.A
ENC_CLICK  (via drill 0.3)
  Top 0.152: v16.46,62.03 16.46,65.53 18.14,67.21 v18.14,68.28
  Bottom 0.152: v16.46,62.03 16.46,55.63 22.55,49.53 22.55,47.55 UC1.2 | v18.14,68.28 20.42,70.56 20.42,72.08 22.4,74.07 SW1.E
FINE_TUNE
  Bottom 0.152: UC1.13 16,49.07 12.19,49.07 C31.1 12.04,48.92 12.04,46.63 8.08,42.67 8.08,37.64 7.01,36.58 R19.P$2
FM_CV  (via drill 0.3)
  Top 0.152: v6.86,69.49 0.46,63.09 0.46,38.1 6.4,32.16 v21.64,32.16
  Bottom 0.152: C17.2 30.79,31.55 28.65,31.55 R35.2 28.5,31.55 24.08,31.55 23.47,30.94 IC7.7 23.32,30.94 22.86,30.94 v21.64,32.16 | v6.86,69.49 6.86,71.32 IC4.4
GATE  (via drill 0.3)
  Top 0.152: v8.69,46.94 8.69,44.96 v6.4,42.67
  Bottom 0.152: v8.69,46.94 11.58,49.84 12.65,49.84 12.95,49.53 16,49.53 UC1.14 | v6.4,42.67 6.4,38.41 6.1,38.1 6.1,37.03 5.49,36.42 5.49,35.97 4.88,35.36 4.42,35.36 4.12,35.05 4.12,33.68 | 4.12,33.68 4.12,29.26 4.42,28.96 4.42,25.15 3.81,24.54 Q6.C | 4.12,33.68 5.64,33.68 5.94,33.38 5.94,32.31 5.64,32 5.64,29.41 7.47,27.58 7.47,25.45 R27.1
GND  (via drill 0.3)
  Top 0.152: J1.GND 11.28,17.53 8.23,17.53 4.57,21.18 R38.P$1 | J6.GND 28.65,2.59 28.65,3.35 25.15,6.86 J5.GND 25.15,7.01 25.15,9.45 28.65,12.95 J3.GND 28.65,13.11 28.65,13.87 25.15,17.37 J2.GND | JP2.3 38.56,70.71 38.56,69.65 JP2.5 38.71,69.49 39.47,68.73 39.47,67.82 38.71,67.06 JP2.9 38.56,67.06 34.59,63.09 34.59,61.72 32.61,59.74 v32.61,58.83 31.7,57.91 31.7,50.14 30.63,49.07 30.63,47.09 | 30.63,47.09 30.63,36.58 R36.P$1 | 30.63,47.09 v28.96,47.09 | 6.1,50.29 4.57,51.82 R20.P$1 | 6.1,50.29 6.55,49.84 8.08,49.84 8.84,50.6 v10.82,50.6 10.97,50.6 v13.26,52.88 13.72,52.43 v14.78,52.43 | 22.4,57.3 20.12,59.59 SW1.C 19.96,59.74 19.96,71.63 18.14,73.46 | 22.4,57.3 v24.84,57.3 | 22.4,57.3 v22.55,57.15 | 18.14,73.46 17.53,74.07 SW1.D 18.14,73.46 | JP9.1 14.94,100.28 17.37,100.28 JP10.1 | 17.98,100.28 17.53,100.28 JP10.1 | 17.98,100.28 19.96,100.28 JP12.1 | JP14.1 27.58,100.28 25.15,100.28 JP13.1 24.99,100.28 24.99,102.26 23.01,104.24 JP1.3 | JP1.3 23.01,104.39 23.01,106.83 JP1.4 | 17.98,104.39 20.27,104.39 JP1.5 20.42,104.39 22.86,104.39 JP1.3 | 17.98,106.83 20.27,106.83 JP1.6 | 17.98,106.83 17.98,104.39 | 17.98,104.39 JP1.7 17.98,104.24 17.98,100.28 | 17.98,106.83 JP1.8 | 17.98,100.28 JP10.1 | 18.14,73.46 22.4,77.72 JP6.1 | 6.1,50.29 4.57,48.77 4.57,36.58 R19.P$1
  Bottom 0.152: C20.1 15.09,7.16 14.78,7.16 14.02,6.4 11.89,6.4 11.43,6.86 J4.GND 11.43,7.01 11.43,8.08 12.19,8.84 12.19,11.73 11.58,12.34 C22.2 11.43,12.5 11.43,17.37 J1.GND 11.43,17.53 14.17,17.53 17.83,21.18 17.83,22.86 | R38.P$1 4.42,21.34 4.42,22.25 1.68,24.99 1.68,25.3 Q6.E 1.52,25.45 0.76,26.21 0.76,32.16 4.42,35.81 4.42,36.42 R19.P$1 | J3.GND 28.65,12.95 28.35,12.65 25.45,12.65 C23.2 25.3,12.5 24.54,11.73 22.1,11.73 18.9,8.53 18.9,7.92 IC10.3 | IC7.11 17.22,34.59 17.22,33.53 IC7.10 17.22,33.38 18.14,33.38 18.9,32.61 18.9,30.33 16.76,28.19 16.76,27.89 C28.2 16.61,27.74 13.72,27.74 13.11,27.13 13.11,24.38 13.72,23.77 16.31,23.77 | 16.31,23.77 16.31,23.16 16.61,22.86 IC9.10 17.22,22.86 17.83,22.86 | 16.31,23.77 16.61,24.08 17.07,24.08 IC9.12 | 22.1,22.86 21.64,22.86 21.18,23.32 | 22.1,22.86 22.86,22.86 IC9.5 | 21.18,23.32 21.18,23.62 21.64,24.08 22.86,24.08 IC9.3 | 17.83,22.86 20.73,22.86 21.18,23.32 | J2.GND 24.99,17.53 23.77,18.75 22.71,18.75 C27.1 22.55,18.9 22.1,19.36 22.1,22.86 | C18.2 15.39,41.15 15.39,45.57 16,46.18 C7.2 16.15,46.33 16.15,47.85 19.05,50.75 | UC1.46 24.69,49.99 24.69,49.53 UC1.47 24.69,49.38 25.3,49.38 27.58,47.09 C6.2 | 17.37,52.43 16.15,52.43 UC1.20 16,52.43 v14.78,52.43 | 17.37,52.43 17.83,52.88 17.83,53.19 17.07,53.95 16.15,53.95 UC1.23 | 17.37,52.43 19.05,50.75 | 19.05,50.75 19.66,50.14 19.66,47.55 UC1.8 19.66,47.4 19.66,45.87 18.75,44.96 18.75,41.91 19.05,41.6 19.51,41.6 20.42,42.52 | 20.42,42.52 20.42,42.82 Q5.GND 20.42,42.52 | 20.42,42.52 21.34,41.6 22.25,41.6 27.58,46.94 C6.2 | 22.1,35.2 22.1,34.14 22.71,33.53 23.32,33.53 IC7.5
  Bottom 0.152: 22.1,35.2 22.71,35.81 23.32,35.81 IC7.3 23.47,35.97 25.15,35.97 25.6,36.42 30.48,36.42 R36.P$1 | 22.1,35.2 21.49,35.81 17.22,35.81 IC7.12 | v32.61,58.83 32.61,57.15 IC5.8 | R33.1 38.41,64.16 38.41,66.75 38.56,66.9 JP2.9 | v28.96,47.09 27.74,47.09 C6.2 | v10.82,50.6 12.04,50.6 C31.2 | v13.26,52.88 12.19,52.88 C12.2 | R20.P$1 4.57,51.82 4.72,51.97 4.72,60.66 3.5,61.87 3.5,63.25 C3.2 3.5,63.4 3.5,71.02 4.72,72.24 9.3,72.24 | IC3.2 19.05,64.77 19.05,62.48 19.2,62.33 C8.2 19.36,62.18 19.36,60.35 19.96,59.74 SW1.C | v22.55,57.15 22.55,56.08 UC1.35 | v24.84,57.3 24.84,56.24 C5.2 | SW1.D 17.37,74.07 15.54,72.24 13.11,72.24 C11.2 12.95,72.08 12.95,71.17 11.43,69.65 8.99,69.65 | 8.99,69.65 6.4,67.06 6.4,65.68 IC4.12 | 8.99,69.65 8.99,71.32 IC4.7 8.99,71.48 9.3,71.78 9.3,72.24 | 9.3,72.24 9.3,76.5 IC6.1 | JP10.1 17.53,100.13 17.68,99.97 17.68,95.1 C30.+ 17.83,94.94 17.83,87.94 18.14,87.63 C25.- 18.29,87.48 18.29,83.52 19.96,81.84 C4.2 | C26.2 37.64,77.88 37.8,78.03 37.8,80.31 IC8.1 37.8,80.47 37.03,80.47 36.12,81.38 33.68,81.38 32.16,82.91 C19.- 32,83.06 30.33,83.06 29.11,84.28 22.55,84.28 20.12,81.84 C4.2 | C4.2 20.12,81.69 20.12,80.16 22.4,77.88 JP6.1 22.55,77.88 23.62,78.94 28.04,78.94 30.48,76.5 32.16,76.5 C15.-
  pour Top (isolate 0.012): 0,109.22 40.64,109.22 40.64,0 0,0
  pour Bottom (isolate 0.012): 0,109.22 40.64,109.22 40.64,0 0,0
JTCK  (via drill 0.3)
  Top 0.152: v25.91,59.44 37.19,70.71 JP2.4
  Bottom 0.152: v25.91,59.44 25.91,55.63 25.6,55.32 25.45,55.32 24.69,54.56 UC1.37
JTDI
  Bottom 0.152: UC1.38 24.69,54.1 27.13,54.1 28.5,55.47 33.98,55.47 35.36,56.84 35.36,62.33 35.81,62.79 35.81,66.75 37.19,68.12 JP2.8
JTDO  (via drill 0.3)
  Top 0.152: v28.65,56.24 v28.65,54.86 | v30.48,60.2 30.48,62.79 37.19,69.49 JP2.6
  Bottom 0.152: v28.65,54.86 27.28,53.49 24.69,53.49 UC1.39 | v28.65,56.24 30.48,58.06 v30.48,60.2
JTMS
  Bottom 0.152: UC1.34 22.1,55.93 22.1,55.47 20.27,53.65 18.9,53.65 17.22,55.32 17.22,57.45 18.59,58.83 18.59,61.42 18.44,61.57 18.44,67.82 18.75,68.12 18.75,68.28 20.12,69.65 33.22,69.65 35.66,72.08 37.19,72.08 JP2.2
N$7
  Bottom 0.152: UC1.5 21.18,47.4 21.18,43.43 21.64,42.98 Q5.X1
N$8
  Bottom 0.152: UC1.6 20.57,47.4 20.57,44.65 19.36,43.43 19.36,42.98 Q5.X2
N$12  (via drill 0.3)
  Top 0.152: v36.42,39.32 36.42,37.03 36.58,36.88 36.58,29.87 33.98,27.28 33.98,20.73 32.16,18.9 v27.13,18.9
  Bottom 0.152: IC9.7 23.01,21.49 24.54,21.49 25.91,20.12 R53.2 26.06,19.96 v27.13,18.9 | v36.42,39.32 35.51,40.23 R41.1
N$13  (via drill 0.3)
  Top 0.152: v16,43.74 13.72,43.74 8.53,48.92 v7.47,48.92
  Bottom 0.152: v16,43.74 18.75,41 28.65,41 33.07,45.41 33.07,45.72 R39.1 | v7.47,48.92 7.47,51.21 7.01,51.66 R20.P$2
N$14
  Bottom 0.152: R54.1 27.74,22.25 27.74,21.34 28.5,20.57 28.5,19.36 25.45,16.31 16.31,16.31 15.24,15.24 J2.TIP
N$29
  Bottom 0.152: 33.98,38.56 33.22,38.56 R34.1 33.07,38.56 30.94,38.56 C16.1 30.79,38.41 30.48,38.41 29.41,37.34 23.47,37.34 IC7.2 | 33.98,38.56 35.36,38.56 R41.2 | 33.98,38.56 33.98,40.84 33.22,41.6 33.22,43.89 R39.2
N$45
  Bottom 0.152: IC9.6 23.01,22.25 25.91,22.25 R54.2 26.06,22.25 27.58,20.73 27.58,20.12 R53.1
N$46
  Bottom 0.152: R24.1 38.56,19.2 38.56,15.24 J3.TIP
N$47
  Bottom 0.152: R48.1 1.52,7.47 1.52,4.72 J4.TIP
N$48
  Bottom 0.152: R24.2 38.71,21.03 38.71,26.98 39.17,27.43 39.17,45.57 33.07,51.66 R21.P$2
N$49  (via drill 0.3)
  Top 0.152: v8.38,76.66 10.82,76.66 21.34,87.17 22.71,87.17 v26.21,83.67 23.77,81.23 v23.77,73.15
  Bottom 0.152: v8.38,76.66 4.88,76.66 IC6.2 | v26.21,83.67 27.28,83.67 27.89,83.06 C19.+ | v23.77,73.15 21.49,70.87 R49.1
N$50
  Bottom 0.152: R43.1 14.02,24.84 17.07,24.84 IC9.13 17.22,24.84 21.18,24.84 27.13,30.79 31.55,30.79 32.31,31.55 32.31,32.16 32.46,32.31 33.83,32.31 34.59,31.55 34.59,22.1 35.36,21.34 R37.P$3
N$51  (via drill 0.3)
  Top 0.152: v10.67,38.41 v7.32,41.76
  Bottom 0.152: R43.2 14.02,26.52 15.09,25.45 IC9.14 17.22,25.45 17.37,25.6 17.37,28.35 19.2,30.18 19.2,34.44 18.29,35.36 16,35.36 12.95,38.41 v10.67,38.41 | v7.32,41.76 7.32,40.84 R30.1
N$52
  Bottom 0.152: IC9.2 23.01,24.84 25.6,24.84 R52.1 25.76,24.84 30.79,24.84 34.44,21.18 34.44,20.88 35.2,20.12 39.17,20.12 39.47,20.42 39.47,47.7 35.51,51.66 R21.P$3
N$53
  Bottom 0.152: IC9.1 23.01,25.45 24.54,25.45 25.6,26.52 R52.2 25.76,26.67 25.76,27.89 27.89,30.02 31.24,30.02 32.77,31.55 33.07,31.55 R42.1
N$55  (via drill 0.3)
  Top 0.152: v26.82,35.05 26.82,45.72 30.48,49.38 30.48,51.66 R21.P$1
  Bottom 0.152: R35.1 28.65,33.22 30.79,33.22 C17.1 30.94,33.22 33.07,33.22 R42.2 33.22,33.22 35.36,33.22 R40.2 | IC7.6 23.47,32.16 27.43,32.16 28.5,33.22 R35.1 | v26.82,35.05 28.5,33.38 R35.1
N$56
  Top 0.152: JP1.2 25.6,106.83 25.6,104.39 JP1.1
  Bottom 0.152: D1.A 37.03,101.8 28.04,101.8 25.6,104.24 JP1.1
N$57
  Bottom 0.152: R29.1 1.52,18.9 1.52,15.24 J1.TIP
N$58
  Bottom 0.152: IC9.8 17.07,21.49 14.48,21.49 14.02,21.03 R44.2 13.87,20.88 13.26,20.88 10.52,18.14 6.55,18.14 5.94,18.75 5.94,21.18 5.18,21.95 5.18,32.77 R31.1
N$59  (via drill 0.3)
  Top 0.152: v5.49,37.95 v6.71,37.95 7.01,37.95 8.08,36.88 8.08,36.42 9.14,35.36 9.91,35.36 12.34,37.8 15.7,37.8 | 15.7,37.8 21.79,37.8 22.25,37.34 22.25,29.87 30.48,21.64 30.48,21.34 R37.P$1 | 15.7,37.8 v15.7,37.95
  Bottom 0.152: 15.85,38.1 16.61,37.34 17.07,37.34 IC7.13 | 15.85,38.1 14.94,39.01 9.6,39.01 R25.1 | C13.1 6.25,44.5 5.79,44.04 5.79,40.23 5.03,39.47 5.03,39.17 R28.2 5.03,39.01 5.49,38.56 v5.49,37.95 | v6.71,37.95 7.16,38.41 7.16,39.01 R30.2 | v15.7,37.95 15.85,38.1
N$60
  Bottom 0.152: R47.1 7.32,17.22 7.32,13.41 7.92,12.8 7.92,8.69 11.89,4.72 15.09,4.72 J5.TIP
N$61  (via drill 0.3)
  Top 0.152: v3.5,39.32 3.5,35.97 4.42,35.05 18.75,35.05 v20.27,36.58
  Bottom 0.152: v3.5,39.32 4.88,40.69 R28.1 | v20.27,36.58 25.3,36.58 25.76,37.03 29.57,37.03 30.02,37.49 32,37.49 32.92,36.58 R36.P$2
N$62  (via drill 0.3)
  Top 0.152: v5.64,9.3 11.58,9.3 21.79,19.51 31.24,19.51 32.92,21.18 R37.P$2
  Bottom 0.152: v5.64,9.3 1.52,9.3 R48.2
N$63
  Bottom 0.152: IC9.9 17.07,22.25 14.33,22.25 14.02,22.55 R44.1 13.87,22.55 10.36,19.05 7.32,19.05 R47.2
N$64
  Top 0.152: JP1.10 15.39,106.83 15.39,104.39 JP1.9
  Bottom 0.152: D2.C 1.83,101.8 12.8,101.8 15.24,104.24 JP1.9
N$65
  Bottom 0.152: R32.1 7.47,32.77 7.47,32.16 8.99,30.63 8.99,26.52 8.38,25.91 8.38,22.71 7.01,21.34 R38.P$2
N$66
  Bottom 0.152: R29.2 1.52,20.73 1.52,23.47 Q6.B
N$67
  Bottom 0.152: 15.39,3.5 15.54,3.5 16.92,4.88 16.92,10.21 18.75,12.04 18.75,12.95 IC10.6 18.9,13.11 19.96,13.11 IC10.7 | 15.39,3.5 9.6,3.5 6.25,6.86 6.25,10.21 6.86,10.82 6.86,12.34 C21.2 | 15.39,3.5 18.29,0.61 35.97,0.61 39.62,4.27 39.62,7.32 35.2,11.73 35.2,12.19 C24.+
N$68
  Bottom 0.152: R50.2 20.42,1.68 21.49,1.68 22.25,0.91 23.47,0.91 23.77,1.22 23.77,2.44 30.33,8.99 35.05,8.99 C24.-
N$69
  Bottom 0.152: R46.1 13.11,9.6 13.11,12.34 C22.1 13.26,12.5 16.92,12.5 17.37,12.95 IC10.5
N$70
  Bottom 0.152: 6.25,34.59 7.32,34.59 R32.2 7.47,34.59 9.6,34.59 R26.1 9.75,34.44 12.04,32.16 17.07,32.16 IC7.9 | 6.25,34.59 5.18,34.59 R31.2 | 6.25,34.59 6.25,31.85 6.4,31.7 6.4,30.18 C14.1
N$71
  Bottom 0.152: C21.1 8.69,12.34 8.69,9.6 R45.1 8.84,9.6 11.28,9.6 R46.2
N$72
  Bottom 0.152: R55.1 24.54,1.83 26.52,1.83 28.35,3.66 29.41,3.66 29.57,3.5 35.05,3.5 35.51,3.96 R56.1 35.66,4.12 36.12,4.57 38.41,4.57 J6.TIP
N$73
  Bottom 0.152: R55.2 22.71,1.83 20.57,3.96 20.57,4.42 C29.2 20.57,4.57 21.18,5.18 21.18,7.77 IC10.1
N$75
  Bottom 0.152: R50.1 18.75,1.83 18.75,4.42 C29.1 18.9,4.57 18.9,6.1 19.96,7.16 19.96,7.77 IC10.2 20.12,7.92 20.12,8.38 22.25,10.52 35.97,10.52 36.12,10.36 36.12,7.92 35.66,7.47 35.66,5.94 R56.2
PARAM1_CV  (via drill 0.3)
  Top 0.152: v7.92,43.43 v9.6,41.76
  Bottom 0.152: IC7.14 17.07,38.56 15.85,38.56 13.72,40.69 9.6,40.69 R25.2 9.6,40.84 v9.6,41.76 | IC4.1 5.03,71.32 5.03,66.6 4.57,66.14 4.57,61.27 5.33,60.5 5.33,54.86 8.08,52.12 8.08,44.65 C13.2 7.92,44.5 v7.92,43.43
PARAM2_CV  (via drill 0.3)
  Top 0.152: v0.76,64.16 v5.64,69.04 | v0.76,37.03 1.07,37.03 v7.01,31.09
  Bottom 0.152: v5.64,69.04 5.64,71.32 IC4.2 | v0.76,37.03 v0.76,64.16 | C14.2 8.08,30.02 v7.01,31.09 7.01,31.55 6.55,32 6.55,33.38 6.86,33.68 7.92,33.68 8.69,32.92 9.6,32.92 R26.2 9.75,32.77 11.58,30.94 17.07,30.94 IC7.8
PITCH_CV  (via drill 0.3)
  Top 0.152: v6.25,68.12 6.25,67.21 0.76,61.72 0.76,38.25 4.27,34.75 19.2,34.75 v21.64,37.19
  Bottom 0.152: R34.2 33.07,40.23 30.94,40.23 C16.2 30.79,40.08 24.99,40.08 23.47,38.56 IC7.1 23.32,38.41 22.86,38.41 v21.64,37.19 | v6.25,68.12 6.25,71.32 IC4.3
RESET  (via drill 0.3)
  Top 0.152: v20.27,50.6 20.27,51.66 25.6,57 29.41,57 34.29,61.87 34.29,64.01 35.2,64.92 | 35.2,64.92 37.19,66.9 JP2.10 | 35.2,64.92 v34.29,65.84
  Bottom 0.152: v20.27,50.6 20.27,47.55 UC1.7 | v34.29,65.84 34.29,66.9 R22.1
VCC  (via drill 0.3)
  Top 0.152: v21.79,23.47 v18.44,26.82 | v20.27,76.35 21.34,77.42 21.34,85.95 v21.64,86.26 | v22.86,30.02 22.86,32.61 26.52,36.27 26.52,49.53 27.43,50.44 v27.43,55.17 | v26.52,57.76 25.15,57.76 24.99,57.91 23.77,57.91 23.32,58.37 23.32,58.67 23.62,58.98 23.62,65.38 20.27,68.73 20.27,72.08 v19.96,72.39
  Bottom 0.152: v18.44,26.82 18.44,27.74 C28.1 18.44,27.89 20.73,27.89 v22.86,30.02 | v21.79,23.47 22.86,23.47 IC9.4 23.01,23.47 28.04,23.47 28.8,22.71 28.8,17.68 23.77,12.65 C23.1 23.62,12.65 23.32,12.95 21.34,12.95 IC10.8 | D1.C 37.03,97.84 33.22,97.84 23.01,87.63 C25.+ 22.86,87.48 v21.64,86.26 | 18.75,72.39 18.75,73.15 20.27,74.68 v20.27,76.35 | 18.75,72.39 18.75,70.87 R49.2 | v27.43,55.17 27.43,56.84 v26.52,57.76 | 18.75,72.39 v19.96,72.39
VEE  (via drill 0.3)
  Top 0.152: v18.14,23.47 v20.88,20.73 29.57,20.73 30.18,20.12 30.79,20.12 31.7,21.03 31.7,33.68 34.44,36.42 34.44,49.23 36.58,51.36 36.58,57 35.2,58.37 v35.2,62.94 | v35.2,70.26 35.2,71.63 v37.49,73.91
  Bottom 0.152: v18.14,23.47 17.22,23.47 IC9.11 | v20.88,20.73 20.88,18.9 C27.2 20.88,18.75 17.07,18.75 14.02,15.7 14.02,14.78 14.63,14.17 16.92,14.17 17.22,14.48 17.83,14.48 18.14,14.17 | 18.14,14.17 18.14,11.89 13.56,7.32 C20.2 | 18.14,14.17 18.44,14.48 20.42,14.48 20.73,14.17 20.73,11.58 17.53,8.38 17.53,7.92 IC10.4 | D2.A 1.83,97.99 5.79,97.99 9.3,101.5 17.98,101.5 18.75,100.74 18.75,98.91 22.55,95.1 C30.- 22.55,94.94 21.03,93.42 21.03,86.11 21.49,85.65 31.85,85.65 35.81,81.69 37.8,81.69 38.56,80.92 38.56,77.42 37.64,76.5 37.64,75.13 R51.1 37.49,74.98 v37.49,73.91 | v35.2,70.26 v35.2,62.94

### Text on the board
bNames: Mod by Codex-Modulex - 2018 - v3.0 | µOSC-I | CC-BY-SA-3.0 | Original design by Olivier Gillet